# EAGLE design ExenMiniShield (EAGLE 9.1.0)

## Sheet 1 of 3
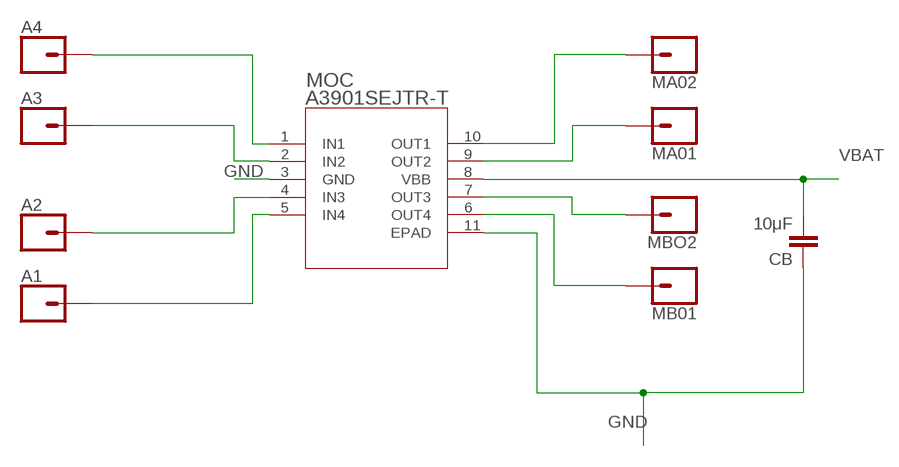
[diagram p0: schematic, sheet 1]

### Parts
A1  CONN_01PTH_NO_SILK_YES_STOP  [1X01_NO_SILK]
A2  CONN_01PTH_NO_SILK_YES_STOP  [1X01_NO_SILK]
A3  CONN_01PTH_NO_SILK_YES_STOP  [1X01_NO_SILK]
A4  CONN_01PTH_NO_SILK_YES_STOP  [1X01_NO_SILK]
CB  10μF  4.7PF-0603-50V-5%  [0603]
MA01  CONN_01PTH_NO_SILK_YES_STOP  [1X01_NO_SILK]
MA02  CONN_01PTH_NO_SILK_YES_STOP  [1X01_NO_SILK]
MB01  CONN_01PTH_NO_SILK_YES_STOP  [1X01_NO_SILK]
MBO2  CONN_01PTH_NO_SILK_YES_STOP  [1X01_NO_SILK]
MOC  A3901SEJTR-T  [DFN-10_DD]

### Nets
GND: CB.1 MOC.3(GND) MOC.11(EPAD) ; also sheet 2,3
MA01: MBO2.1 MOC.7(OUT3)
MA02: MB01.1 MOC.6(OUT4)
MB01: MA02.1 MOC.10(OUT1)
MB02: MA01.1 MOC.9(OUT2)
N$4: A1.1 MOC.5(IN4)
N$5: A2.1 MOC.4(IN3)
N$6: A4.1 MOC.1(IN1)
N$7: A3.1 MOC.2(IN2)
VBAT: CB.2 MOC.8(VBB) ; also sheet 2

## Sheet 2 of 3
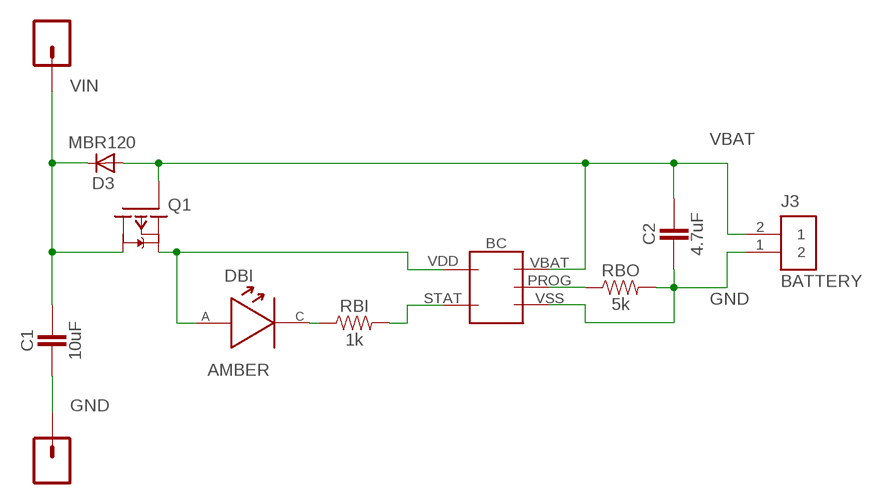
[diagram p1: schematic, sheet 2]

### Parts
BC  BATTERYCHARGER  [SOT-753]
C1  10uF  CAPACITOR  [PASSIVE-0603]
C2  4.7uF  CAPACITOR  [PASSIVE-0603]
D3  MBR120  AS-ITM-00111  [SOD-123FL]
DBI  AMBER  DIODE  [PASSIVE-0603]
GND  CONN_01PTH_NO_SILK_YES_STOP  [1X01_NO_SILK]
J3  BATTERY  AS-ITM-00231  [JST_SH_2X1]
Q1  DMP2035U  AS-ITM-00024  [SOT23]
RBI  1k  RESISTOR  [PASSIVE-0603]
RBO  5k  RESISTOR  [PASSIVE-0603]
VIN  CONN_01PTH_NO_SILK_YES_STOP  [1X01_NO_SILK]

### Nets
GND: BC.VSS C1.1 C2.1 GND.1 J3.1 RBO.2 ; also sheet 1,3
N$1: DBI.2(CATHODE) RBI.1
N$2: BC.STAT RBI.2
N$3: BC.PROG RBO.1
VBAT: BC.VBAT C2.2 D3.A J3.2 Q1.B(G) ; also sheet 1
VDD: BC.VDD DBI.1(ANODE) Q1.E(S)
VIN: C1.2 D3.C Q1.C(D) VIN.1

## Sheet 3 of 3
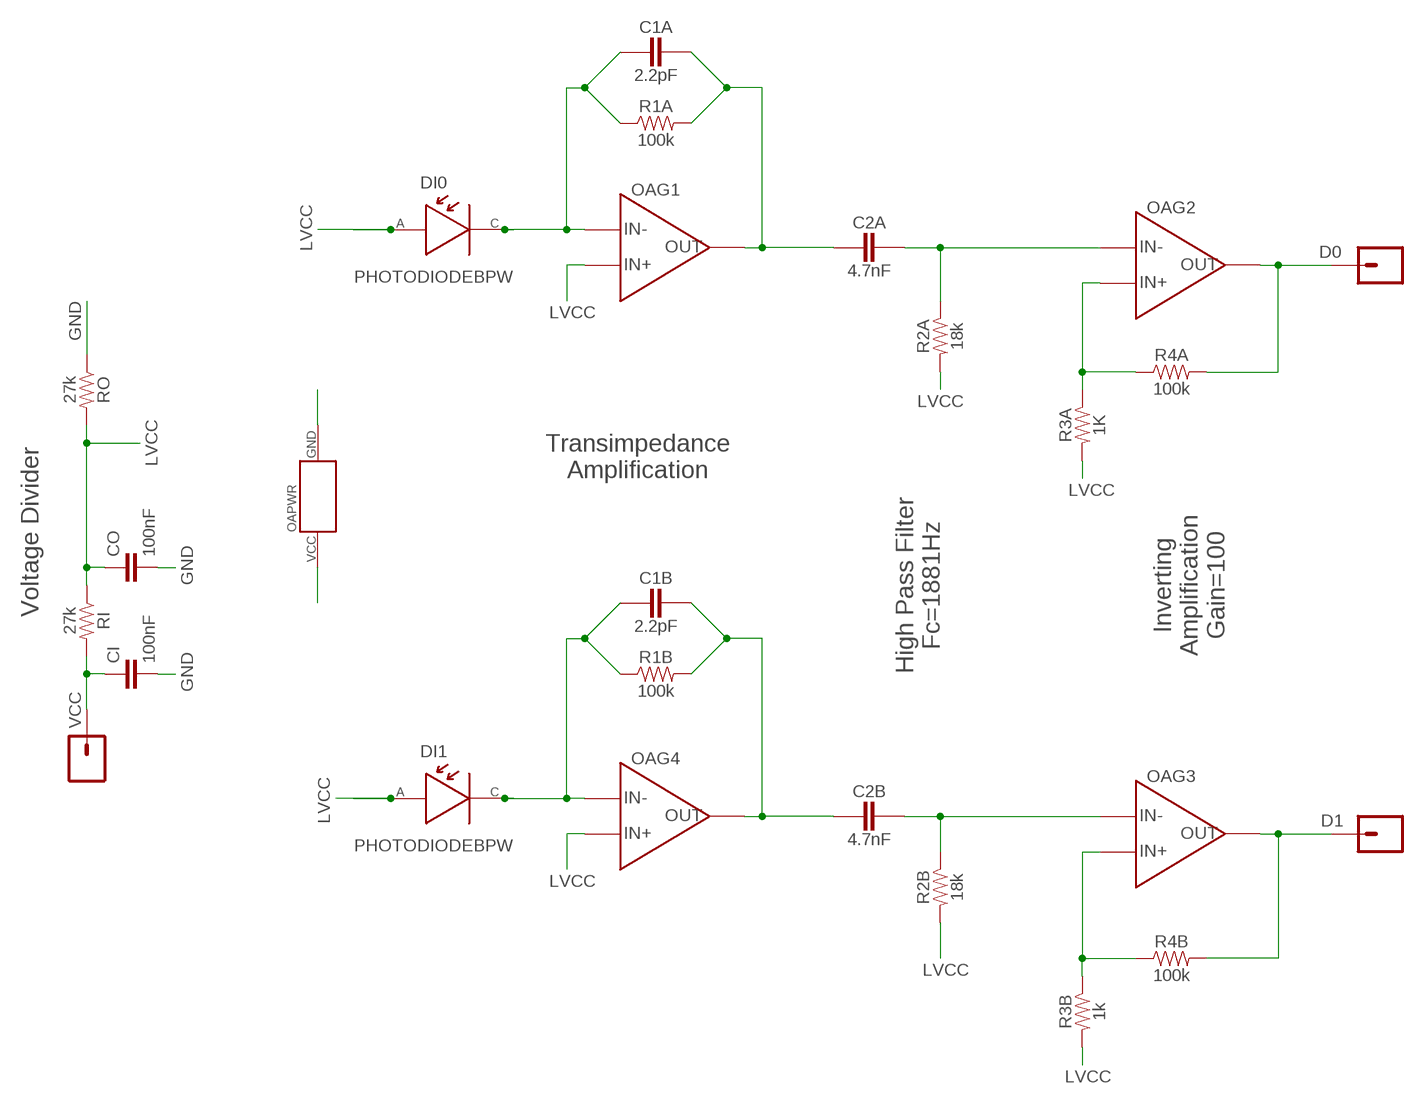
[diagram p2: schematic, sheet 3]

### Parts
C1A  2.2pF  CAPACITOR  [PASSIVE-0603]
C1B  2.2pF  CAPACITOR  [PASSIVE-0603]
C2A  4.7nF  CAPACITOR  [PASSIVE-0603]
C2B  4.7nF  CAPACITOR  [PASSIVE-0603]
CI  100nF  4.7PF-0603-50V-5%  [0603]
CO  100nF  4.7PF-0603-50V-5%  [0603]
D0  CONN_01PTH_NO_SILK_YES_STOP  [1X01_NO_SILK]
D1  CONN_01PTH_NO_SILK_YES_STOP  [1X01_NO_SILK]
DI0  PHOTODIODEBPW  [BPW34_BP104_SMD]
DI1  PHOTODIODEBPW  [BPW34_BP104_SMD]
OA  TLV2464IPW  [PW14]
R1A  100k  RESISTOR  [PASSIVE-0603]
R1B  100k  RESISTOR  [PASSIVE-0603]
R2A  18k  RESISTOR  [PASSIVE-0603]
R2B  18k  RESISTOR  [PASSIVE-0603]
R3A  1K  RESISTOR  [PASSIVE-0603]
R3B  1k  RESISTOR  [PASSIVE-0603]
R4A  100k  RESISTOR  [PASSIVE-0603]
R4B  100k  RESISTOR  [PASSIVE-0603]
RI  27k  100KOHM-0603-1/10W-1%  [0603]
RO  27k  100KOHM-0603-1/10W-1%  [0603]
VCC  CONN_01PTH_NO_SILK_YES_STOP  [1X01_NO_SILK]

### Nets
D0: D0.1 OA.7(OUT) R4A.2
D1: D1.1 OA.8(OUT) R4B.2
D1IN: C1B.1 DI1.CATHODE OA.13(IN-) R1B.1
D1OA2P: C2B.2 OA.9(IN-) R2B.1
D1OAOUT1: C1B.2 C2B.1 OA.14(OUT) R1B.2
D2IN: C1A.1 DI0.CATHODE OA.2(IN-) R1A.1
D2OA1OUT: C1A.2 C2A.1 OA.1(OUT) R1A.2
D2OA2N: OA.5(IN+) R3A.1 R4A.1
D2OA2P: C2A.2 OA.6(IN-) R2A.1
GND: CI.2 CO.2 OA.11(PWR:GND) RO.1 ; also sheet 1,2
LVCC: CO.1 DI0.ANODE DI1.ANODE OA.3(IN+) OA.12(IN+) R2A.2 R2B.2 R3A.2 R3B.2 RI.1 RO.2
N$11: OA.10(IN+) R3B.1 R4B.1
VCC: CI.1 OA.4(PWR:VCC) RI.2 VCC.1

### Notes on the sheet
- Transimpedance
  Amplification
- Voltage Divider
- High Pass Filter
  Fc=1881Hz
- Inverting
  Amplification
  Gain=100

## Library data of the parts
A1-A4 D0 D1 GND MA01 MA02 MB01 MBO2 VCC VIN = SparkFun-Connectors:CONN_01: Single connection point. Often used as Generic Header-pin footprint for 0.1 inch spaced/style header connections On any of the 0.1 inch spaced packages, you can populate with these: Break Away Headers - Straight <https://www.sparkfun.com/products/116> (PRT-00116) Break Away Male Headers - Right Angle <https://www.sparkfun.com/products/553> (PRT-00553) Female Headers <https://www.sparkfun.com/products/115> (PRT-00115) Break Away Headers - Machine Pin <https://www.sparkfun.com/products/117> (PRT-00117) Break Away Female Headers - Swiss Machine Pin <https://www.sparkfun.com/products/743> (PRT-00743) This device is also useful as a general connection point to wire up your design to another part of your project. Our various solder wires solder well into these plated through hole pads. Hook-Up Wire - Assortment (Stranded, 22 AWG) <https://www.sparkfun.com/products/11375> (PRT-11375) Hook-Up Wire - Assortment (Solid Core, 22 AWG) <https://www.sparkfun.com/products/11367> (PRT-11367) View the entire wire category on our website here <https://www.sparkfun.com/categories/141> Special notes: SMTSO-256-ET is a "flush mount" nut for a 4-40 screw. We mostly use this on specialty testbeds; it is a nice way to connect hardware to your PCB at an adjustable hieght. Also note, the SNAP packages are for using a snappable style connector. We sell a baggie of snaps and they are also used on two LilyPad designs: Snap Assortment - 30 pack (male and female) <https://www.sparkfun.com/products/11347> (DEV-11347) LilyPad Arduino SimpleSnap <https://www.sparkfun.com/products/10941> (DEV-10941) LilyPad SimpleSnap Protoboard <https://www.sparkfun.com/products/10940> (DEV-10940)
BC = ZippyComponentLibrary:BATTERYCHARGER: "Provides a soldering placement for a 3x2 right-angle header."
C1 C1A C1B C2 C2A C2B = ZippyComponentLibrary:CAPACITOR
CB CI CO = SparkFun-Capacitors:4.7PF: 4.7pF ceramic capacitors A capacitor is a passive two-terminal electrical component used to store electrical energy temporarily in an electric field.; PROD_ID: CAP-07880; VALUE: 4.7pF
D3 = tinycircuits:AS-ITM-00111: DIODE SCHOTTKY 20V 1A SOD123L; PARTNO: AS-ITM-00111; VALUE: MBR120VLSFT1G
DBI = ZippyComponentLibrary:DIODE: 2x1 SMD Diode Mounting Point
DI0 DI1 = ZippyComponentLibrary:PHOTODIODE: "2x1 SMD Mounting Point For BPW34 Diode"
J3 = tinycircuits:AS-ITM-00231: CONN HEADER SH 2POS SIDE 1MM; PARTNO: AS-ITM-00231; PNPROTATION: 180; VALUE: SM02B-SRSS-TB(LF)(SN)
MOC = ZippyComponentLibrary:A3901SEJTR-T
OA = ZippyComponentLibrary:TLV2464
Q1 = tinycircuits:AS-ITM-00024: P-Channel MOSFET SOT-23; PARTNO: AS-ITM-00024; PNPROTATION: 0
R1A R1B R2A R2B R3A R3B R4A R4B RBI RBO = ZippyComponentLibrary:RESISTOR
RI RO = SparkFun-Resistors:100KOHM: 100kΩ resistor A resistor is a passive two-terminal electrical component that implements electrical resistance as a circuit element. Resistors act to reduce current flow, and, at the same time, act to lower voltage levels within circuits. - Wikipedia; PROD_ID: RES-07828; VALUE: 100k

## Board
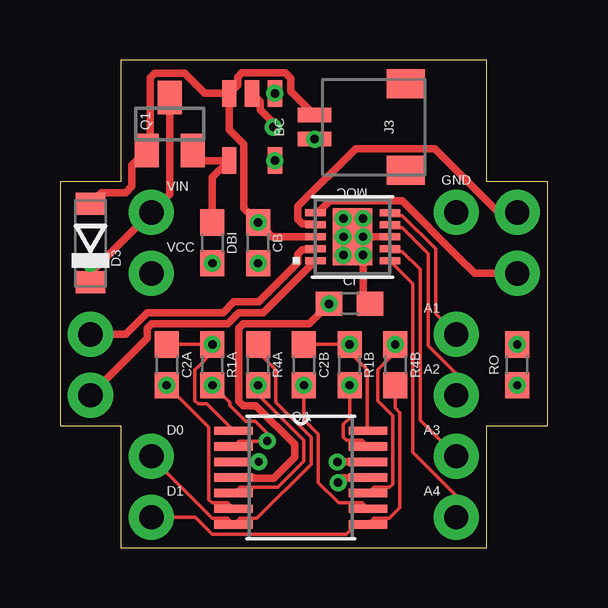
[diagram p3: board, top side]
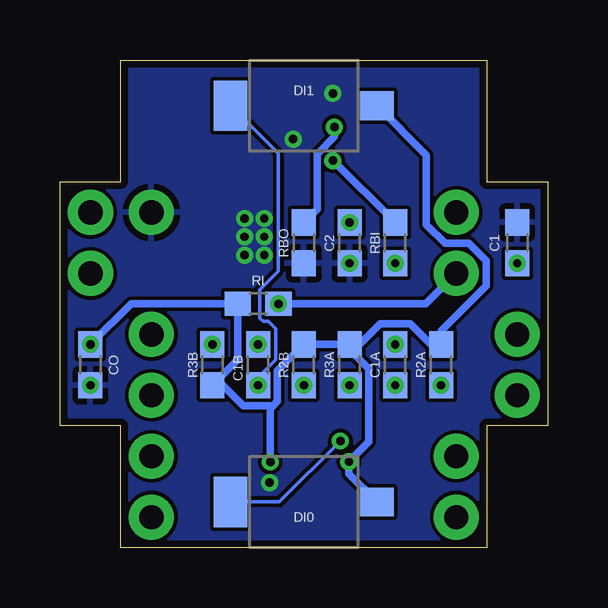
[diagram p4: board, bottom side, seen from below]

Size 20.32 x 20.32 mm. Coordinates in mm from the lower left corner, seen from the top.
Outline: 0,5.08 2.54,5.08 2.54,0 17.78,0 17.78,5.08 20.32,5.08 20.32,15.24 17.78,15.24 17.78,20.32 5.08,20.31 2.54,20.32 2.54,15.24 0,15.24 0,5.08
Copper layers (1*16): Top 0.0356mm / dielectric 1.5011mm / Bottom 0.0356mm
Design rules "LaenPCBOrder *": minimum track width 6mil, minimum drill 13mil, track to track 6mil, track to pad 6mil, pad to pad 6mil, via to via 6mil, smd to smd 6mil, copper to edge 12mil, drill to drill 6mil, minimum pad ring 7mil, minimum via ring 7mil, stop-mask expansion 3mil, vias tented up to drill 0mil, thermal gap 10mil

### Footprints (pad centres in the part's own frame; a part is rotated, then mirrored left to right if it is on the bottom)
1X01_NO_SILK = drill 1.016 pad 1.88: 1 0,0
SOT-753 = smd 0.6 x 1.1: PROG 0,-1.4; STAT -0.95,1.4; VBAT 0.95,-1.4; VDD 0.95,1.4; VSS -0.95,-1.4
PASSIVE-0603 = smd 1.1 x 1: 1 -0.85,0; 2 0.85,0
0603 = smd 1.1 x 1: 1 -0.85,0; 2 0.85,0
SOD-123FL = smd 0.914 x 1.219: A 1.638,0; C -1.638,0
BPW34_BP104_SMD = smd 1.4 x 1.2: ANODE -3.05,0 | smd 1.4 x 2.1: CATHODE 3.05,0
JST_SH_2X1 = smd 0.6 x 1.4: 1 -0.5,2.475; 2 0.5,2.475 | smd 1.2 x 1.6: PAD1 -1.8,-1.325; PAD2 1.8,-1.325
DFN-10_DD = smd 0.85 x 0.3: 1 -1.55,1; 2 -1.55,0.5; 3 -1.55,0; 4 -1.55,-0.5; 5 -1.55,-1; 6 1.55,-1; 7 1.55,-0.5; 8 1.55,0; 9 1.55,0.5; 10 1.55,1 | smd 1.65 x 2.38: 11 0,0
PW14 = smd 1.6 x 0.35: 1 -2.8,1.95; 2 -2.8,1.3; 3 -2.8,0.65; 4 -2.8,0; 5 -2.8,-0.65; 6 -2.8,-1.3; 7 -2.8,-1.95; 8 2.8,-1.95; 9 2.8,-1.3; 10 2.8,-0.65; 11 2.8,0; 12 2.8,0.65; 13 2.8,1.3; 14 2.8,1.95
SOT23 = smd 1 x 1.4: B -0.95,-1.1; C 0,1.1; E 0.95,-1.1

### Placement (x,y rotation side)
A1  16.51,8.89 0 top
A2  16.51,6.35 0 top
A3  16.51,3.81 0 top
A4  16.51,1.27 0 top
BC  8,17.53 180 top
C1  1.27,12.7 270 bottom
C1A  6.35,7.62 90 bottom
C1B  12.06,7.62 90 bottom
C2  8.26,12.7 90 bottom
C2A  4.45,7.62 270 top
C2B  10.16,7.62 270 top
CB  8.26,12.7 90 top
CI  12.06,10.16 0 top
CO  19.05,7.62 270 bottom
D0  3.81,3.81 0 top
D1  3.81,1.27 0 top
D3  1.27,12.7 90 top
DBI  6.35,12.7 270 top
DI0  10.16,1.91 180 bottom
DI1  10.16,18.41 180 bottom
GND  16.51,13.97 0 top
J3  13.08,17.53 90 top
MA01  1.27,8.89 0 top
MA02  1.27,6.35 0 top
MB01  19.05,11.43 0 top
MBO2  19.05,13.97 0 top
MOC  12.19,12.95 180 top
OA  10.03,2.92 0 top
Q1  4.57,17.65 0 top
R1A  6.35,7.62 90 top
R1B  12.06,7.62 90 top
R2A  4.45,7.62 90 bottom
R2B  10.16,7.62 90 bottom
R3A  8.26,7.62 90 bottom
R3B  13.97,7.62 270 bottom
R4A  8.26,7.62 90 top
R4B  13.97,7.62 270 top
RBI  6.35,12.7 90 bottom
RBO  10.16,12.7 270 bottom
RI  12.06,10.16 0 bottom
RO  19.05,7.62 90 top
VCC  3.81,11.43 0 top
VIN  3.81,13.97 0 top

### Tracks (layer width: path | path; a pad name or v marks a point on that pad's centre or on a via)
D0
  Top 0.152: D0.1 3.96,3.65 3.96,3.59 6.34,1.22 6.99,1.22 OA.7 7.48,1.22 8.2,1.22 10.46,3.48 10.46,4.59 8.98,6.07 8.98,7.42 8.26,8.14 R4A.2
D1
  Top 0.152: D1.1 5.64,1.27 6.34,0.57 11.94,0.57 12.34,0.97 OA.8 13.08,1.22 13.73,1.22 14.17,1.66 14.17,5.63 13.97,5.83 R4B.2
D1IN  (via drill 0.35)
  Top 0.152: OA.13 12.59,4.47 11.94,4.47 11.8,4.6 11.8,5.14 12.06,5.4 R1B.1
  Bottom 0.152: DI1.CATHODE 11.23,16.43 11.23,11.52 11.99,10.76 11.99,9.56 11.86,9.43 11.65,9.43 11.34,9.12 11.34,7.83 12.06,7.1 R1B.1
  other vias: 12.06,6.77
D1OA2P  (via drill 0.35)
  Top 0.152: OA.9 12.59,1.87 11.61,1.87 10.76,2.71 10.76,4.72 10.16,5.32 C2B.2
  other vias: 10.16,6.77
D1OAOUT1  (via drill 0.35)
  Top 0.152: OA.14 12.79,4.91 12.79,7.42 12.06,8.14 C1B.2 C2B.1
  other vias: 12.06,8.47
D2IN  (via drill 0.35)
  Top 0.152: OA.2 7.46,4.45 v8.64,4.45 8.64,4.77 8.13,5.28 7.73,5.28 7.07,5.94 7.07,6.05 C1A.1
  Bottom 0.152: v8.64,4.45 11.18,1.91 DI0.CATHODE
  other vias: 6.35,6.77
D2OA1OUT  (via drill 0.35)
  Top 0.152: C2A.1 C1A.2 6.35,8.14 5.77,7.56 5.62,7.42 5.62,6.12 5.75,5.99 6.11,5.99 OA.1
  other vias: 6.35,8.47
D2OA2N  (via drill 0.35)
  Top 0.152: OA.5 7.48,2.52 9.07,2.52 10.15,3.6 10.15,4.47 8.26,6.37 R4A.1
  other vias: 8.26,6.77
D2OA2P  (via drill 0.35)
  Top 0.152: R2A.1 6.2,5.01 6.2,2 6.34,1.87 6.99,1.87 OA.6
  other vias: 4.45,6.77
GND  (via drill 0.35)
  Top 0.305: OA.11 12.07,2.92 12.07,2.91 11.79,2.91 v11.59,2.71 | MOC.11 MOC.3 | MOC.11 12.63,12.52 v12.63,12.19 12.63,10.45 CI.2 | MOC.11 12.19,12.57 v11.81,12.19 | MOC.11 v11.81,12.95 | MOC.11 12.19,13.34 v11.81,13.72 | MOC.11 12.19,13.28 v12.63,13.72
  other vias: 8.26,11.85 8.95,18.93 10.61,17.03 12.63,12.95 19.05,6.77
  pour Bottom: 20.32,15.24 17.78,15.24 17.78,20.32 2.54,20.32 2.54,15.24 0,15.24 0,5.08 2.54,5.08 2.54,0 17.78,0 17.78,5.08 20.32,5.08
LVCC  (via drill 0.35)
  Top 0.305: OA.12 v11.56,3.57 | OA.3 v8.28,3.58
  Bottom 0.305: DI1.ANODE 5.05,16.36 5.05,13.45 4.28,12.68 3.29,12.68 2.56,11.95 2.56,10.91 4.45,9.04 R2A.2 4.87,8.47 5.72,9.32 6.98,9.32 7.83,8.47 R3A.2 | 11.44,5.92 12.69,5.92 13.55,6.77 R3B.2 12.91,7.83 RI.1 17.36,10.16 CO.1 | 11.44,5.92 11.26,6.09 11.26,7.36 10.96,7.67 R2B.2 R3A.2 | v11.56,3.57 11.56,5.8 11.44,5.92 | R3A.2 8.26,8.25 7.45,7.45 7.45,4.41 v8.28,3.58 8.28,3.08 DI0.ANODE
  other vias: 19.05,8.47
MA01
  Top 0.305: MBO2.1 18.27,13.97 15.61,16.63 12.31,16.63 9.91,14.23 9.91,13.68 10.09,13.5 10.6,13.5 MOC.7
MA02
  Top 0.305: MB01.1 17.27,11.43 16.57,12.13 14.25,14.45 11.24,14.45 10.75,13.95 MOC.6
MB01
  Top 0.305: MOC.10 8.47,9.78 7.44,9.78 6.98,9.32 3.82,9.32 3.64,9.15 3.64,8.72 MA02.1
MB02
  Top 0.305: MOC.9 10.6,12.41 10.09,12.41 9.91,12.23 9.91,11.87 8.28,10.24 7.25,10.24 6.79,9.78 3.63,9.78 2.74,8.89 MA01.1
N$1  (via drill 0.35)
  other vias: 6.35,11.85
N$2  (via drill 0.35)
  Bottom 0.305: RBI.2 8.93,16.13 BC.STAT
  other vias: 8.95,16.13
N$3  (via drill 0.35)
  Top 0.305: BC.PROG 8.35,18.58 8.35,18.25 8.89,17.71 v8.89,17.53
  Bottom 0.305: v8.89,17.53 8.89,17.12 9.61,16.4 9.61,15.24 9.61,14.1 RBO.1
N$4
  Top 0.152: A1.1 15.65,9.75 15.65,12.45 14.26,13.83 13.86,13.83 MOC.5
N$5
  Top 0.152: MOC.4 13.86,13.33 14.26,13.33 15.34,12.25 15.34,8.41 16.51,7.24 A2.1
N$6
  Top 0.152: MOC.1 14.7,11 14.7,10.16 14.7,3.97 16.51,2.16 A4.1
N$7
  Top 0.152: A3.1 15,5.32 15,11.59 14.26,12.33 13.86,12.33 MOC.2
N$11  (via drill 0.35)
  Top 0.152: OA.10 13.08,2.52 13.73,2.52 13.86,2.65 13.86,5.5 13.24,6.12 13.24,7.42 13.97,8.14 R3B.1
  other vias: 13.97,8.47
VBAT  (via drill 0.35)
  Top 0.305: D3.A 1.71,14.78 2.73,14.78 3,15.05 3,15.93 Q1.B 3.77,16.7 3.77,19.58 3.95,19.76 5.2,19.76 6.03,18.93 BC.VBAT | BC.VBAT 7.05,17.41 7.66,16.8 7.66,14.15 C2.2 8.85,12.95 MOC.8 | BC.VBAT 7.4,19.27 7.4,19.6 7.58,19.78 9.38,19.78 9.61,19.55 9.61,19.02 J3.2
  other vias: 8.26,13.55
VCC  (via drill 0.35)
  Top 0.305: OA.4 8.09,2.92 8.11,2.9 8.91,2.9 9.77,3.76 9.77,4.31 8.17,5.92 7.63,5.92 7.45,6.09 7.45,9.15 7.63,9.32 10.38,9.32 CI.1
  Bottom 0.305: VCC.1 5.08,10.16 5.71,10.16 9.53,10.16 CI.1
  other vias: 11.21,10.16
VDD
  Top 0.305: Q1.E 5.95,16.13 BC.VDD 6.35,15.43 DBI.1
VIN  (via drill 0.35)
  Top 0.305: Q1.C 4.57,14.73 VIN.1 2.54,12.7 1.27,11.43 D3.C C1.2
  other vias: 1.27,11.85